# Altium schematic sheet Sheet1.SchDoc
size 594 x 420 mm; PageSetup: Record=PageOptions|CenterHorizontal=True|CenterVertical=True|PrintScale=0.94|XCorrection=1.00|YCorrection=1.00|PrintKind=1|BorderSize=5000000|LeftOffset=0|BottomOffset=0|Orientation=1|PaperLength=1000|PaperWidth=1000|Scale=100|PaperSource=7|PrintQuality=-4|MediaType=1|DitherType=10|PaperKind=A4|PrintScaleMode=1; DecimalNumber: Децимальный номер; HeadOfSector: Нач. сектора; MainDevice: Перв.примен.; Name: Наименование
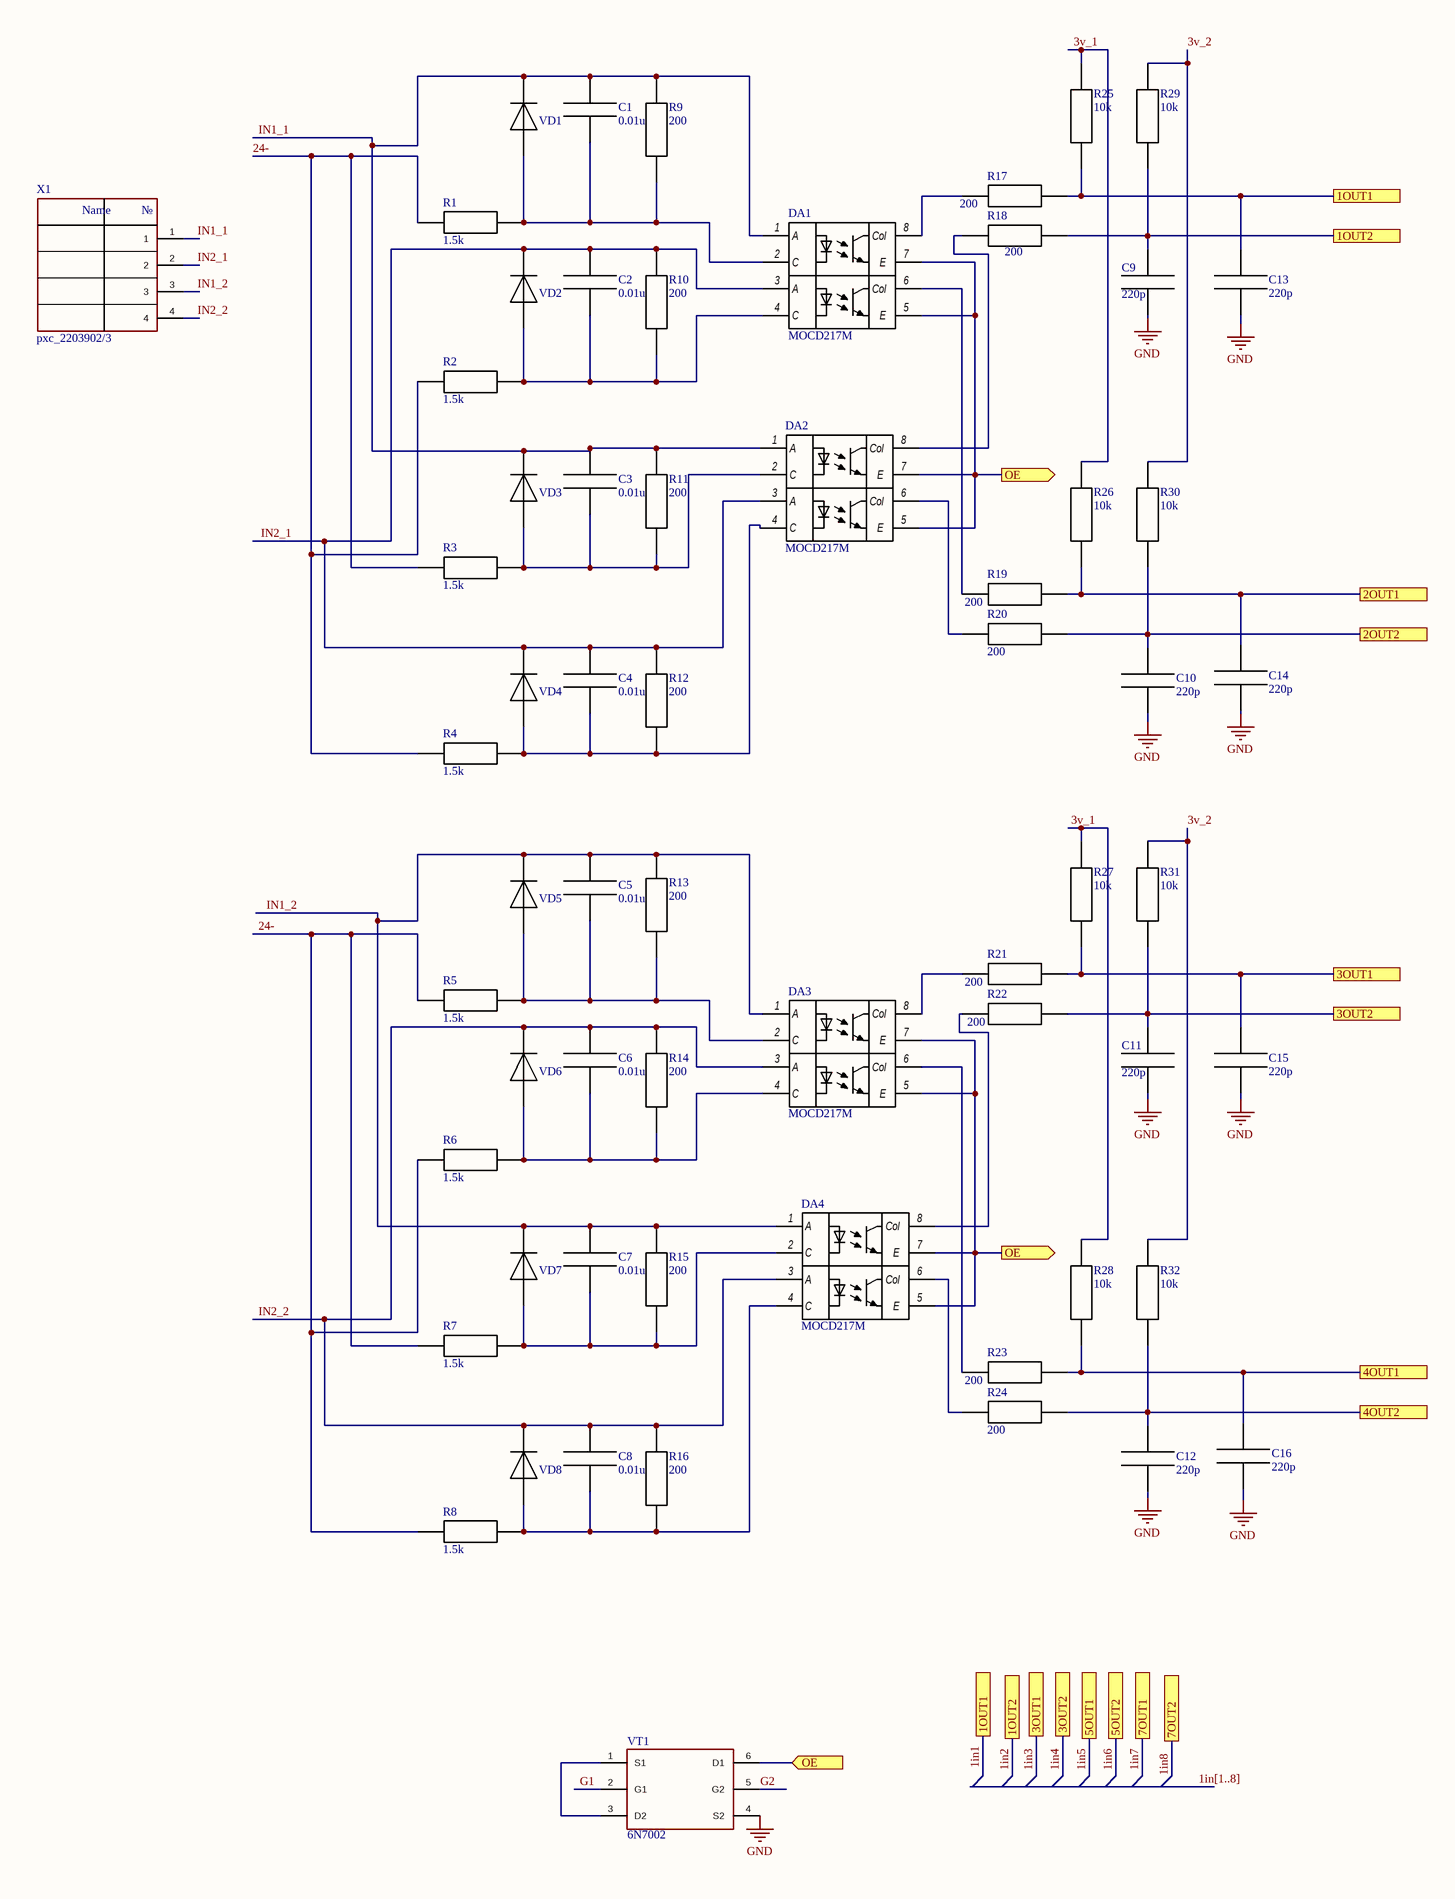
[diagram p0: Sheet1.SchDoc, left]
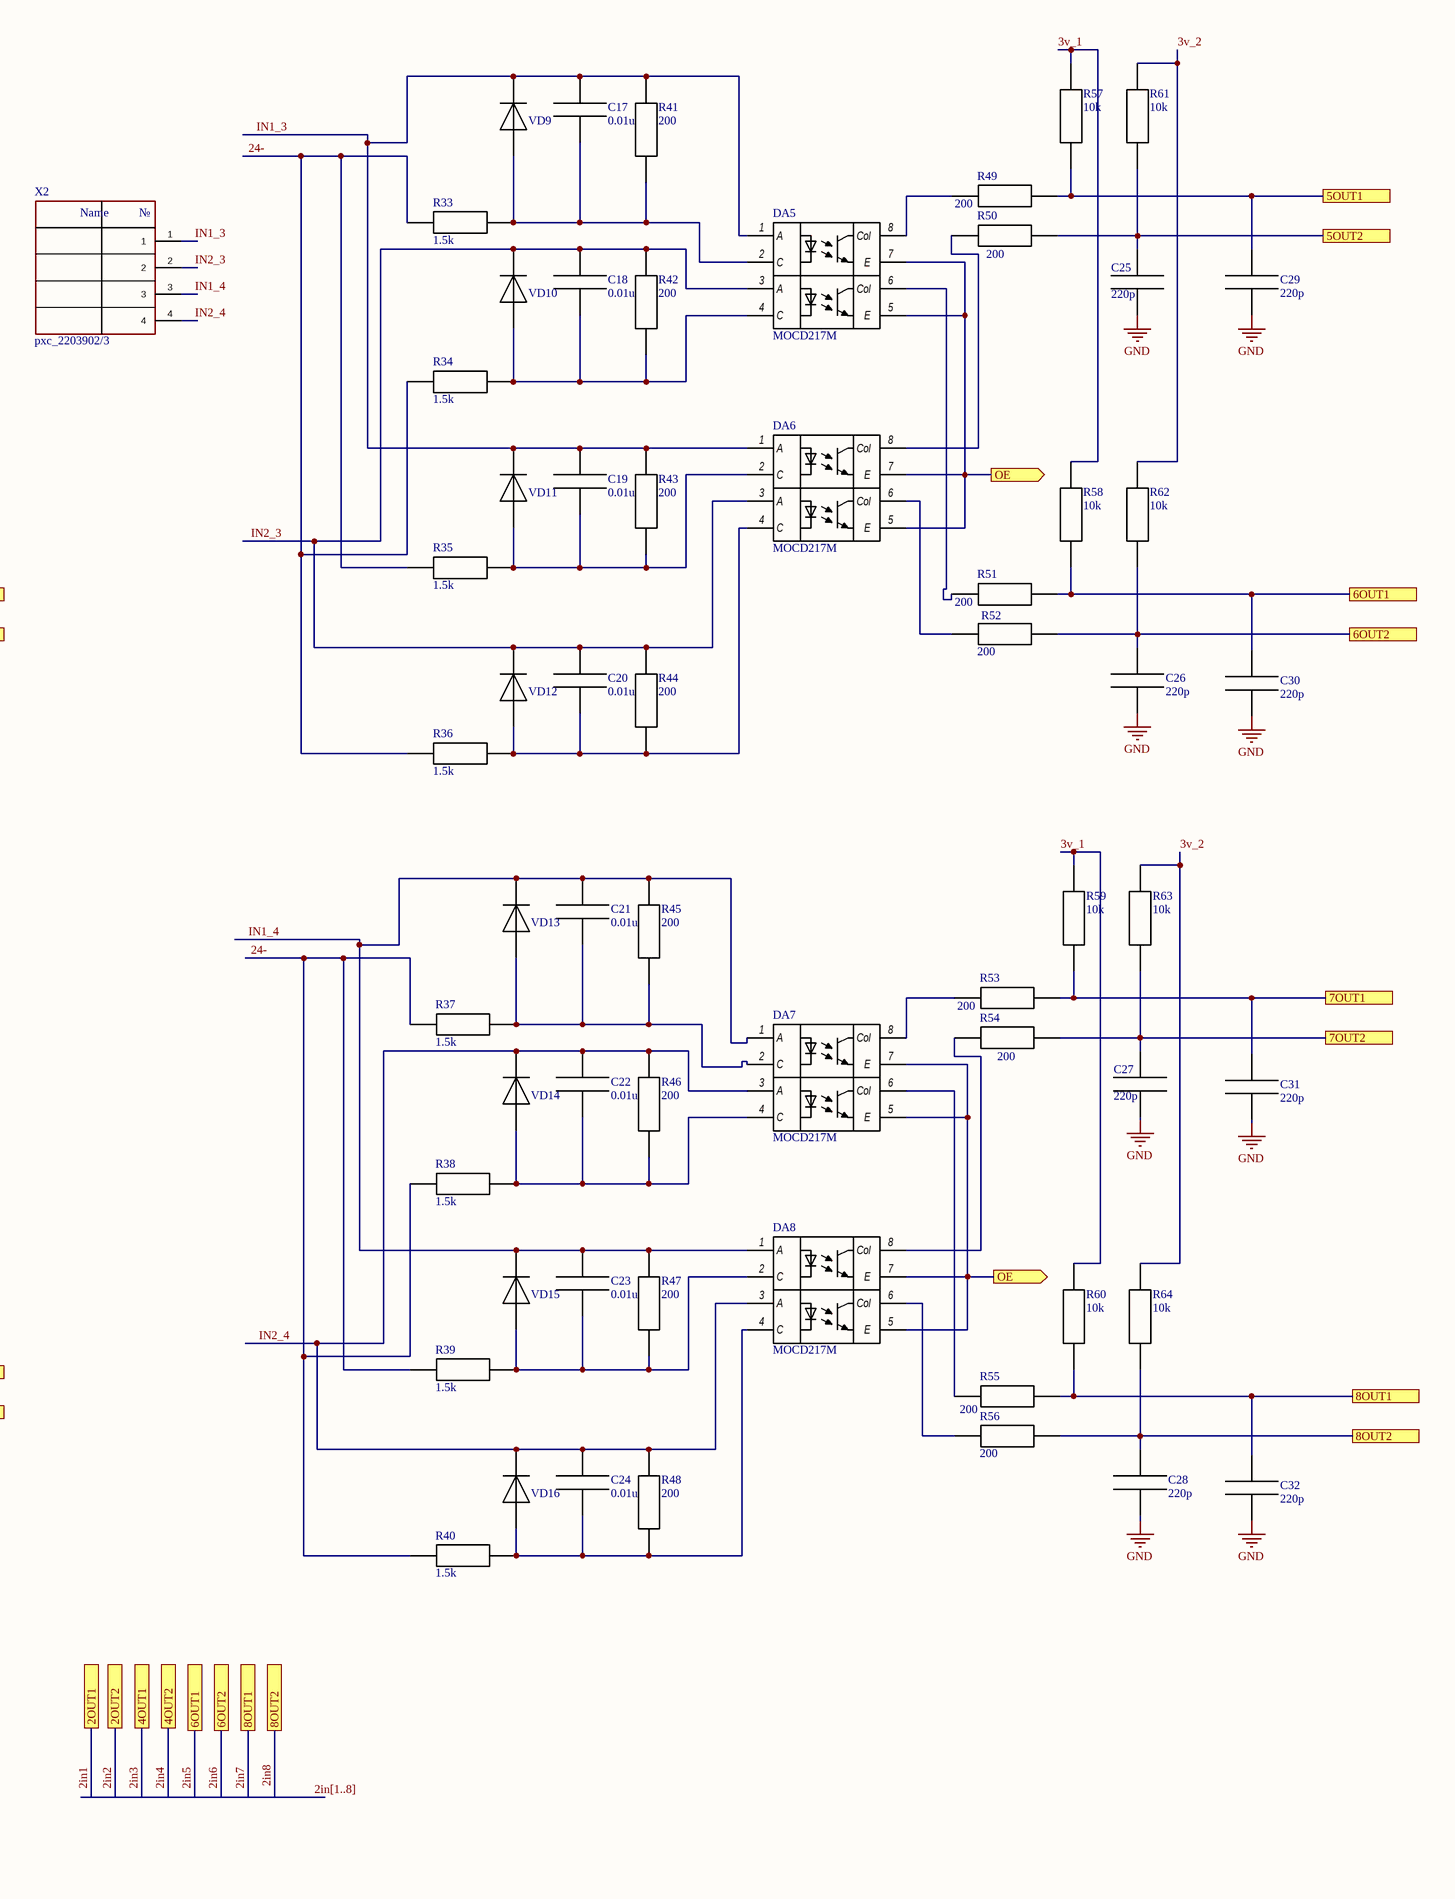
[diagram p1: Sheet1.SchDoc, right]

## Parts
C1  0.01u  [0603_cap]
C2  0.01u  [0603_cap]
C3  0.01u  [0603_cap]
C4  0.01u  [0603_cap]
C5  0.01u  [0603_cap]
C6  0.01u  [0603_cap]
C7  0.01u  [0603_cap]
C8  0.01u  [0603_cap]
C9  220p  [cap_0402]
C10  220p  [cap_0402]
C11  220p  [cap_0402]
C12  220p  [cap_0402]
C13  220p  [cap_0402]
C14  220p  [cap_0402]
C15  220p  [cap_0402]
C16  220p  [cap_0402]
C17  0.01u  [0603_cap]
C18  0.01u  [0603_cap]
C19  0.01u  [0603_cap]
C20  0.01u  [0603_cap]
C21  0.01u  [0603_cap]
C22  0.01u  [0603_cap]
C23  0.01u  [0603_cap]
C24  0.01u  [0603_cap]
C25  220p  [cap_0402]
C26  220p  [cap_0402]
C27  220p  [cap_0402]
C28  220p  [cap_0402]
C29  220p  [cap_0402]
C30  220p  [cap_0402]
C31  220p  [cap_0402]
C32  220p  [cap_0402]
DA1  MOCD217M  [SO-8_optocup]
DA2  MOCD217M  [SO-8_optocup]
DA3  MOCD217M  [SO-8_optocup]
DA4  MOCD217M  [SO-8_optocup]
DA5  MOCD217M  [SO-8_optocup]
DA6  MOCD217M  [SO-8_optocup]
DA7  MOCD217M  [SO-8_optocup]
DA8  MOCD217M  [SO-8_optocup]
R1  1.5k  [2512_res]
R2  1.5k  [2512_res]
R3  1.5k  [2512_res]
R4  1.5k  [2512_res]
R5  1.5k  [2512_res]
R6  1.5k  [2512_res]
R7  1.5k  [2512_res]
R8  1.5k  [2512_res]
R9  200  [0603_res]
R10  200  [0603_res]
R11  200  [0603_res]
R12  200  [0603_res]
R13  200  [0603_res]
R14  200  [0603_res]
R15  200  [0603_res]
R16  200  [0603_res]
R17  200  [res_0402]
R18  200  [res_0402]
R19  200  [res_0402]
R20  200  [res_0402]
R21  200  [res_0402]
R22  200  [res_0402]
R23  200  [res_0402]
R24  200  [res_0402]
R25  10k  [res_0402]
R26  10k  [res_0402]
R27  10k  [res_0402]
R28  10k  [res_0402]
R29  10k  [res_0402]
R30  10k  [res_0402]
R31  10k  [res_0402]
R32  10k  [res_0402]
R33  1.5k  [2512_res]
R34  1.5k  [2512_res]
R35  1.5k  [2512_res]
R36  1.5k  [2512_res]
R37  1.5k  [2512_res]
R38  1.5k  [2512_res]
R39  1.5k  [2512_res]
R40  1.5k  [2512_res]
R41  200  [0603_res]
R42  200  [0603_res]
R43  200  [0603_res]
R44  200  [0603_res]
R45  200  [0603_res]
R46  200  [0603_res]
R47  200  [0603_res]
R48  200  [0603_res]
R49  200  [res_0402]
R50  200  [res_0402]
R51  200  [res_0402]
R52  200  [res_0402]
R53  200  [res_0402]
R54  200  [res_0402]
R55  200  [res_0402]
R56  200  [res_0402]
R57  10k  [res_0402]
R58  10k  [res_0402]
R59  10k  [res_0402]
R60  10k  [res_0402]
R61  10k  [res_0402]
R62  10k  [res_0402]
R63  10k  [res_0402]
R64  10k  [res_0402]
VD1  1N4448  [sod-323]  (value not drawn)
VD2  1N4448  [sod-323]  (value not drawn)
VD3  1N4448  [sod-323]  (value not drawn)
VD4  1N4448  [sod-323]  (value not drawn)
VD5  1N4448  [sod-323]  (value not drawn)
VD6  1N4448  [sod-323]  (value not drawn)
VD7  1N4448  [sod-323]  (value not drawn)
VD8  1N4448  [sod-323]  (value not drawn)
VD9  1N4448  [sod-323]  (value not drawn)
VD10  1N4448  [sod-323]  (value not drawn)
VD11  1N4448  [sod-323]  (value not drawn)
VD12  1N4448  [sod-323]  (value not drawn)
VD13  1N4448  [sod-323]  (value not drawn)
VD14  1N4448  [sod-323]  (value not drawn)
VD15  1N4448  [sod-323]  (value not drawn)
VD16  1N4448  [sod-323]  (value not drawn)
VT1  6N7002  [sot-23-6]
X1  pxc_2203902/3  [pxc_2203902]
X2  pxc_2203902/3  [pxc_2203902]

## Ports
1OUT1, 1OUT2, 2OUT1, 2OUT2, 3OUT1, 3OUT2, 4OUT1, 4OUT2, 5OUT1, 5OUT2, 6OUT1, 6OUT2, 7OUT1, 7OUT2, 8OUT1, 8OUT2, OE (in), OE (out)

## Nets
GND: C9.1 C10.1 C11.1 C12.1 C13.1 C14.1 C15.1 C16.1 C25.1 C26.1 C27.1 C28.1 C29.1 C30.1 C31.1 C32.1 VT1.4(S2)
1in1: C13.2 R17.2 R25.1 ; port 1OUT1
1in2: C9.2 R18.2 R29.1 ; port 1OUT2
1in3: C15.2 R21.2 R27.1 ; port 3OUT1
1in4: C11.2 R22.2 R31.1 ; port 3OUT2
1in5: C29.2 R49.2 R57.1 ; port 5OUT1
1in6: C25.2 R50.2 R61.1 ; port 5OUT2
1in7: C31.2 R53.2 R59.1 ; port 7OUT1
1in8: C27.2 R54.2 R63.1 ; port 7OUT2
2in1: C14.2 R19.2 R26.1 ; port 2OUT1
2in2: C10.2 R20.2 R30.1 ; port 2OUT2
2in3: C16.2 R23.2 R28.1 ; port 4OUT1
2in4: C12.2 R24.2 R32.1 ; port 4OUT2
2in5: C30.2 R51.2 R58.1 ; port 6OUT1
2in6: C26.2 R52.2 R62.1 ; port 6OUT2
2in7: C32.2 R55.2 R60.1 ; port 8OUT1
2in8: C28.2 R56.2 R64.1 ; port 8OUT2
3v_1: R25.2 R26.2 R27.2 R28.2 R57.2 R58.2 R59.2 R60.2
3v_2: R29.2 R30.2 R31.2 R32.2 R61.2 R62.2 R63.2 R64.2
24-: R1.1 R2.1 R3.1 R4.1 R5.1 R6.1 R7.1 R8.1 R33.1 R34.1 R35.1 R36.1 R37.1 R38.1 R39.1 R40.1
G1: VT1.2(G1)
G2: VT1.5(G2)
IN1_1: C1.2 C3.2 DA1.1(A) DA2.1(A) R9.2 R11.2 VD1.K VD3.K X1.1
IN1_2: C5.2 C7.2 DA3.1(A) DA4.1(A) R13.2 R15.2 VD5.K VD7.K X1.3
IN1_3: C17.2 C19.2 DA5.1(A) DA6.1(A) R41.2 R43.2 VD9.K VD11.K X2.1
IN1_4: C21.2 C23.2 DA7.1(A) DA8.1(A) R45.2 R47.2 VD13.K VD15.K X2.3
IN2_1: C2.2 C4.2 DA1.3(A) DA2.3(A) R10.2 R12.2 VD2.K VD4.K X1.2
IN2_2: C6.2 C8.2 DA3.3(A) DA4.3(A) R14.2 R16.2 VD6.K VD8.K X1.4
IN2_3: C18.2 C20.2 DA5.3(A) DA6.3(A) R42.2 R44.2 VD10.K VD12.K X2.2
IN2_4: C22.2 C24.2 DA7.3(A) DA8.3(A) R46.2 R48.2 VD14.K VD16.K X2.4
OE: DA1.5(E) DA1.7(E) DA2.5(E) DA2.7(E) DA3.5(E) DA3.7(E) DA4.5(E) DA4.7(E) DA5.5(E) DA5.7(E) DA6.5(E) DA6.7(E) DA7.5(E) DA7.7(E) DA8.5(E) DA8.7(E) VT1.6(D1) ; port OE
NetC1_1: C1.1 DA1.2(C) R1.2 R9.1 VD1.A
NetC2_1: C2.1 DA1.4(C) R2.2 R10.1 VD2.A
NetC3_1: C3.1 DA2.2(C) R3.2 R11.1 VD3.A
NetC4_1: C4.1 DA2.4(C) R4.2 R12.1 VD4.A
NetC5_1: C5.1 DA3.2(C) R5.2 R13.1 VD5.A
NetC6_1: C6.1 DA3.4(C) R6.2 R14.1 VD6.A
NetC7_1: C7.1 DA4.2(C) R7.2 R15.1 VD7.A
NetC8_1: C8.1 DA4.4(C) R8.2 R16.1 VD8.A
NetC17_1: C17.1 DA5.2(C) R33.2 R41.1 VD9.A
NetC18_1: C18.1 DA5.4(C) R34.2 R42.1 VD10.A
NetC19_1: C19.1 DA6.2(C) R35.2 R43.1 VD11.A
NetC20_1: C20.1 DA6.4(C) R36.2 R44.1 VD12.A
NetC21_1: C21.1 DA7.2(C) R37.2 R45.1 VD13.A
NetC22_1: C22.1 DA7.4(C) R38.2 R46.1 VD14.A
NetC23_1: C23.1 DA8.2(C) R39.2 R47.1 VD15.A
NetC24_1: C24.1 DA8.4(C) R40.2 R48.1 VD16.A
NetDA1_6: DA1.6(Col) R19.1
NetDA1_8: DA1.8(Col) R17.1
NetDA2_6: DA2.6(Col) R20.1
NetDA2_8: DA2.8(Col) R18.1
NetDA3_6: DA3.6(Col) R23.1
NetDA3_8: DA3.8(Col) R21.1
NetDA4_6: DA4.6(Col) R24.1
NetDA4_8: DA4.8(Col) R22.1
NetDA5_6: DA5.6(Col) R51.1
NetDA5_8: DA5.8(Col) R49.1
NetDA6_6: DA6.6(Col) R52.1
NetDA6_8: DA6.8(Col) R50.1
NetDA7_6: DA7.6(Col) R55.1
NetDA7_8: DA7.8(Col) R53.1
NetDA8_6: DA8.6(Col) R56.1
NetDA8_8: DA8.8(Col) R54.1
NetVT1_1: VT1.1(S1) VT1.3(D2)

## Buses and harness runs
bus 1in[1..8] = 
bus 2in[1..8]

## Notes on the sheet
- Перв.примен.
- Справ.№
- Подп. и дата
- Инв.№ дубл.
- Взам.инв.№
- Подп.и дата
- Разраб.
- Изм.
- Лист
- № докум.
- Подп.
- Дата
- Лит.
- Масштаб
- Масса
- Т.контр.
- Пров.
- СХЕМА   ЭЛЕКТРИЧЕСКАЯ
- ПРИНЦИПИАЛЬНАЯ
- Листов
- Инв.№ подл.
- Утв.
- Н.контр.
- Нач.сект.
- Формат  A2
- (in symbol pxc_2203902/3) Name; №

## Library data of the parts
C1-C32 = cap
DA1-DA8 = MOCD217M: dual optopair
R1-R64 = res